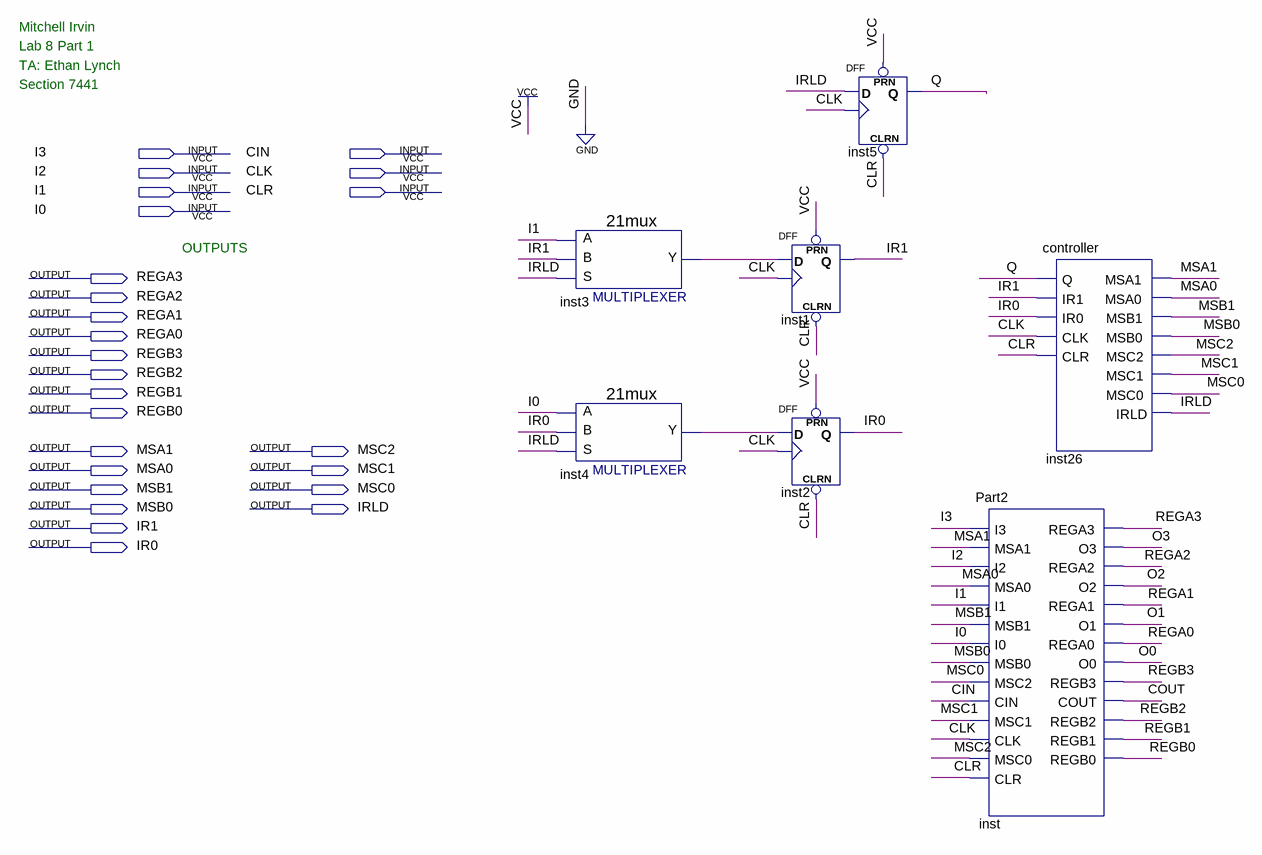
[diagram p0: schematic sheet]
// Quartus schematic part1.bdf as structural Verilog: 7 symbols, 25 pins
module part1 (
  input  I3,
  input  CIN,
  input  I2,
  input  CLK,
  input  I1,
  input  CLR,
  input  I0,
  output REGA3,
  output REGA2,
  output REGA1,
  output REGA0,
  output REGB3,
  output REGB2,
  output REGB1,
  output REGB0,
  output MSA1,
  output MSC2,
  output MSA0,
  output MSC1,
  output MSB1,
  output MSC0,
  output MSB0,
  output IRLD,
  output IR1,
  output IR0
);

  wire COUT, inst3_y, inst4_y, O0, O1, O2, O3, Q;

  \21mux  inst3 (.S(IRLD), .B(IR1), .A(I1), .Y(inst3_y));
  \21mux  inst4 (.S(IRLD), .B(IR0), .A(I0), .Y(inst4_y));
  DFF inst1 (.CLRN(CLR), .CLK(CLK), .D(inst3_y), .PRN(1'b1), .Q(IR1));
  DFF inst2 (.CLRN(CLR), .CLK(CLK), .D(inst4_y), .PRN(1'b1), .Q(IR0));
  DFF inst5 (.CLRN(CLR), .CLK(CLK), .D(IRLD), .PRN(1'b1), .Q(Q));
  Part2 inst (
    .I3(I3), .MSA1(MSA1), .I2(I2), .MSA0(MSA0), .I1(I1), .MSB1(MSB1), .I0(I0), .MSB0(MSB0), .MSC2(MSC0),
    .CIN(CIN), .MSC1(MSC1), .CLK(CLK), .MSC0(MSC2), .CLR(CLR), .REGA3(REGA3), .O3(O3), .REGA2(REGA2),
    .O2(O2), .REGA1(REGA1), .O1(O1), .REGA0(REGA0), .O0(O0), .REGB3(REGB3), .COUT(COUT), .REGB2(REGB2),
    .REGB1(REGB1), .REGB0(REGB0));
  controller inst26 (
    .Q(Q), .IR1(IR1), .IR0(IR0), .CLK(CLK), .CLR(CLR), .MSA1(MSA1), .MSA0(MSA0), .MSB1(MSB1), .MSB0(MSB0),
    .MSC2(MSC2), .MSC1(MSC1), .MSC0(MSC0), .IRLD(IRLD));

  // Notes on the sheet:
  //   Mitchell Irvin
  //   Lab 8
  //   Part 1
  //   TA: Ethan Lynch
  //   Section 7441
  //   OUTPUTS
endmodule
